# EasyEDA Pro project 小智.epro, schematic ESP32-S3-V1_0_1

## Sheets
1 P1: Board Name: 立创·实战派ESP32-S3开发板; Create Date: 2024-10-12; Page Name: P1; Project Name: 立创·实战派ESP32-S3开发板; Schematic Name: ESP32-S3-V1_0_1; Update Date: 2024-10-12; Company: 立创开发板 · 实战派; Page Size: A4; Version: V1.0.1
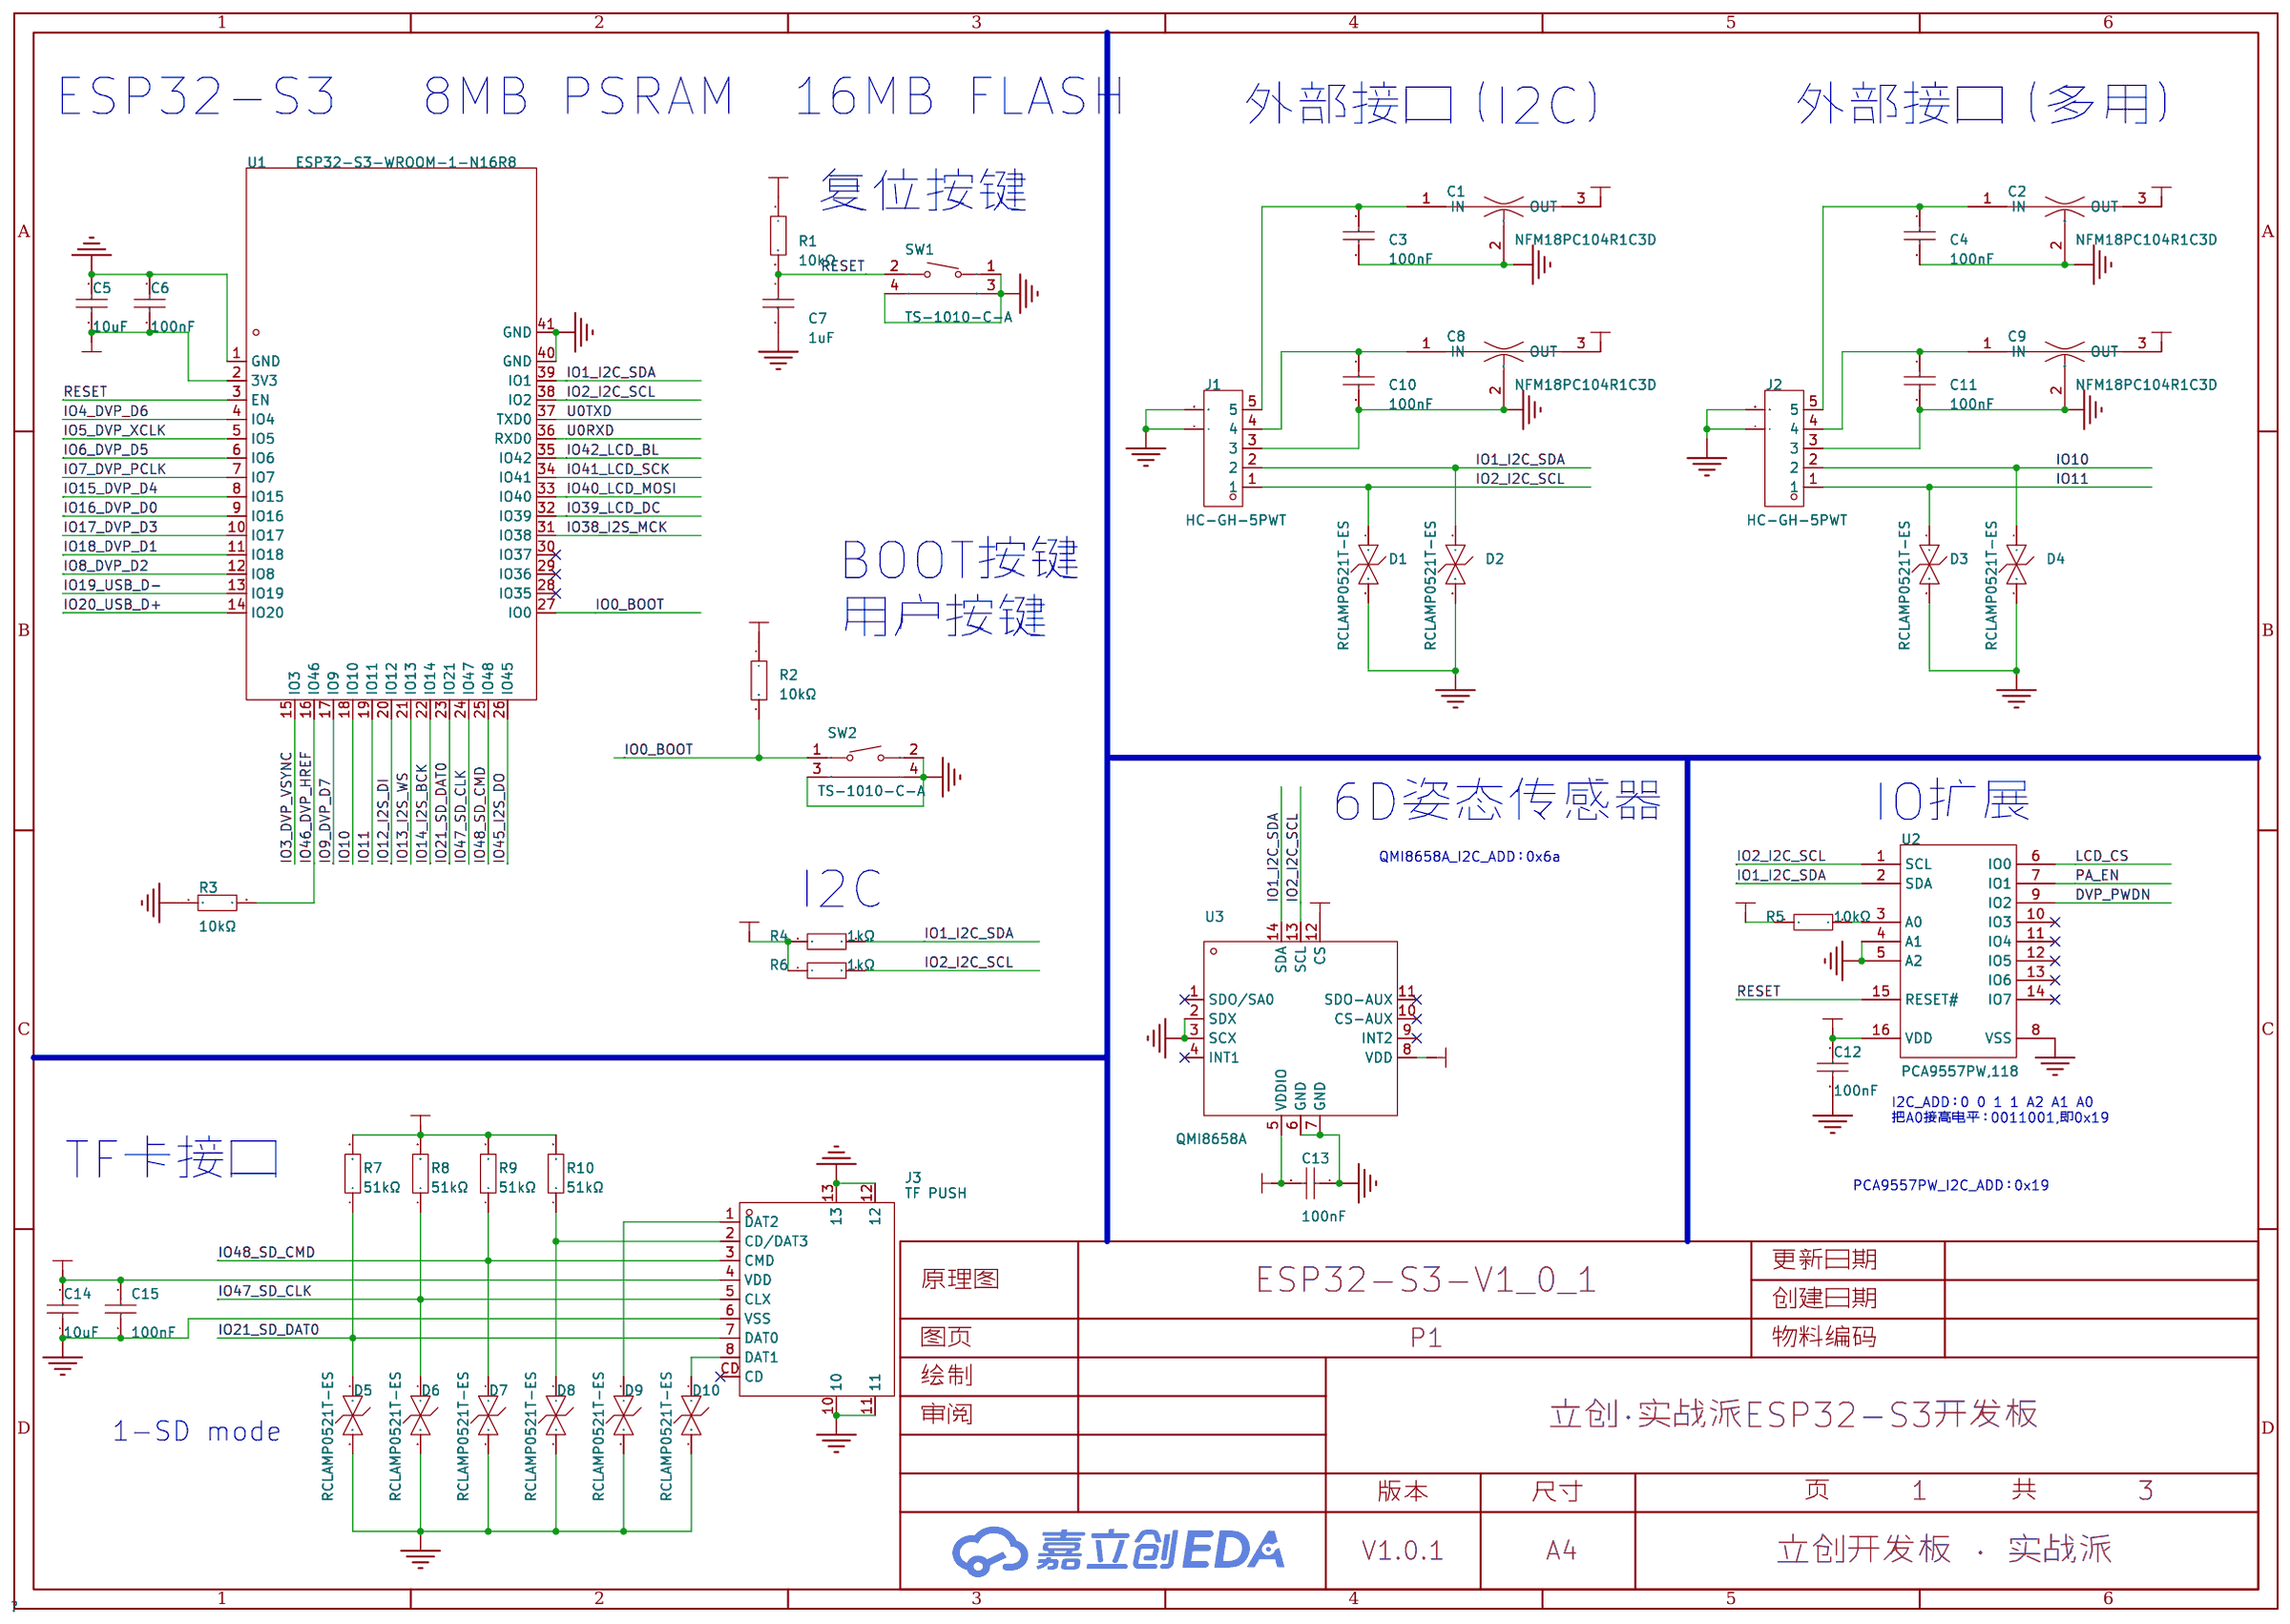
[diagram p0: P1]
2 P2: Board Name: Board1; Create Date: 2024-06-29; Page Name: P2; Project Name: XD-ESP32S3-V1_0_1; Update Date: 2024-08-06
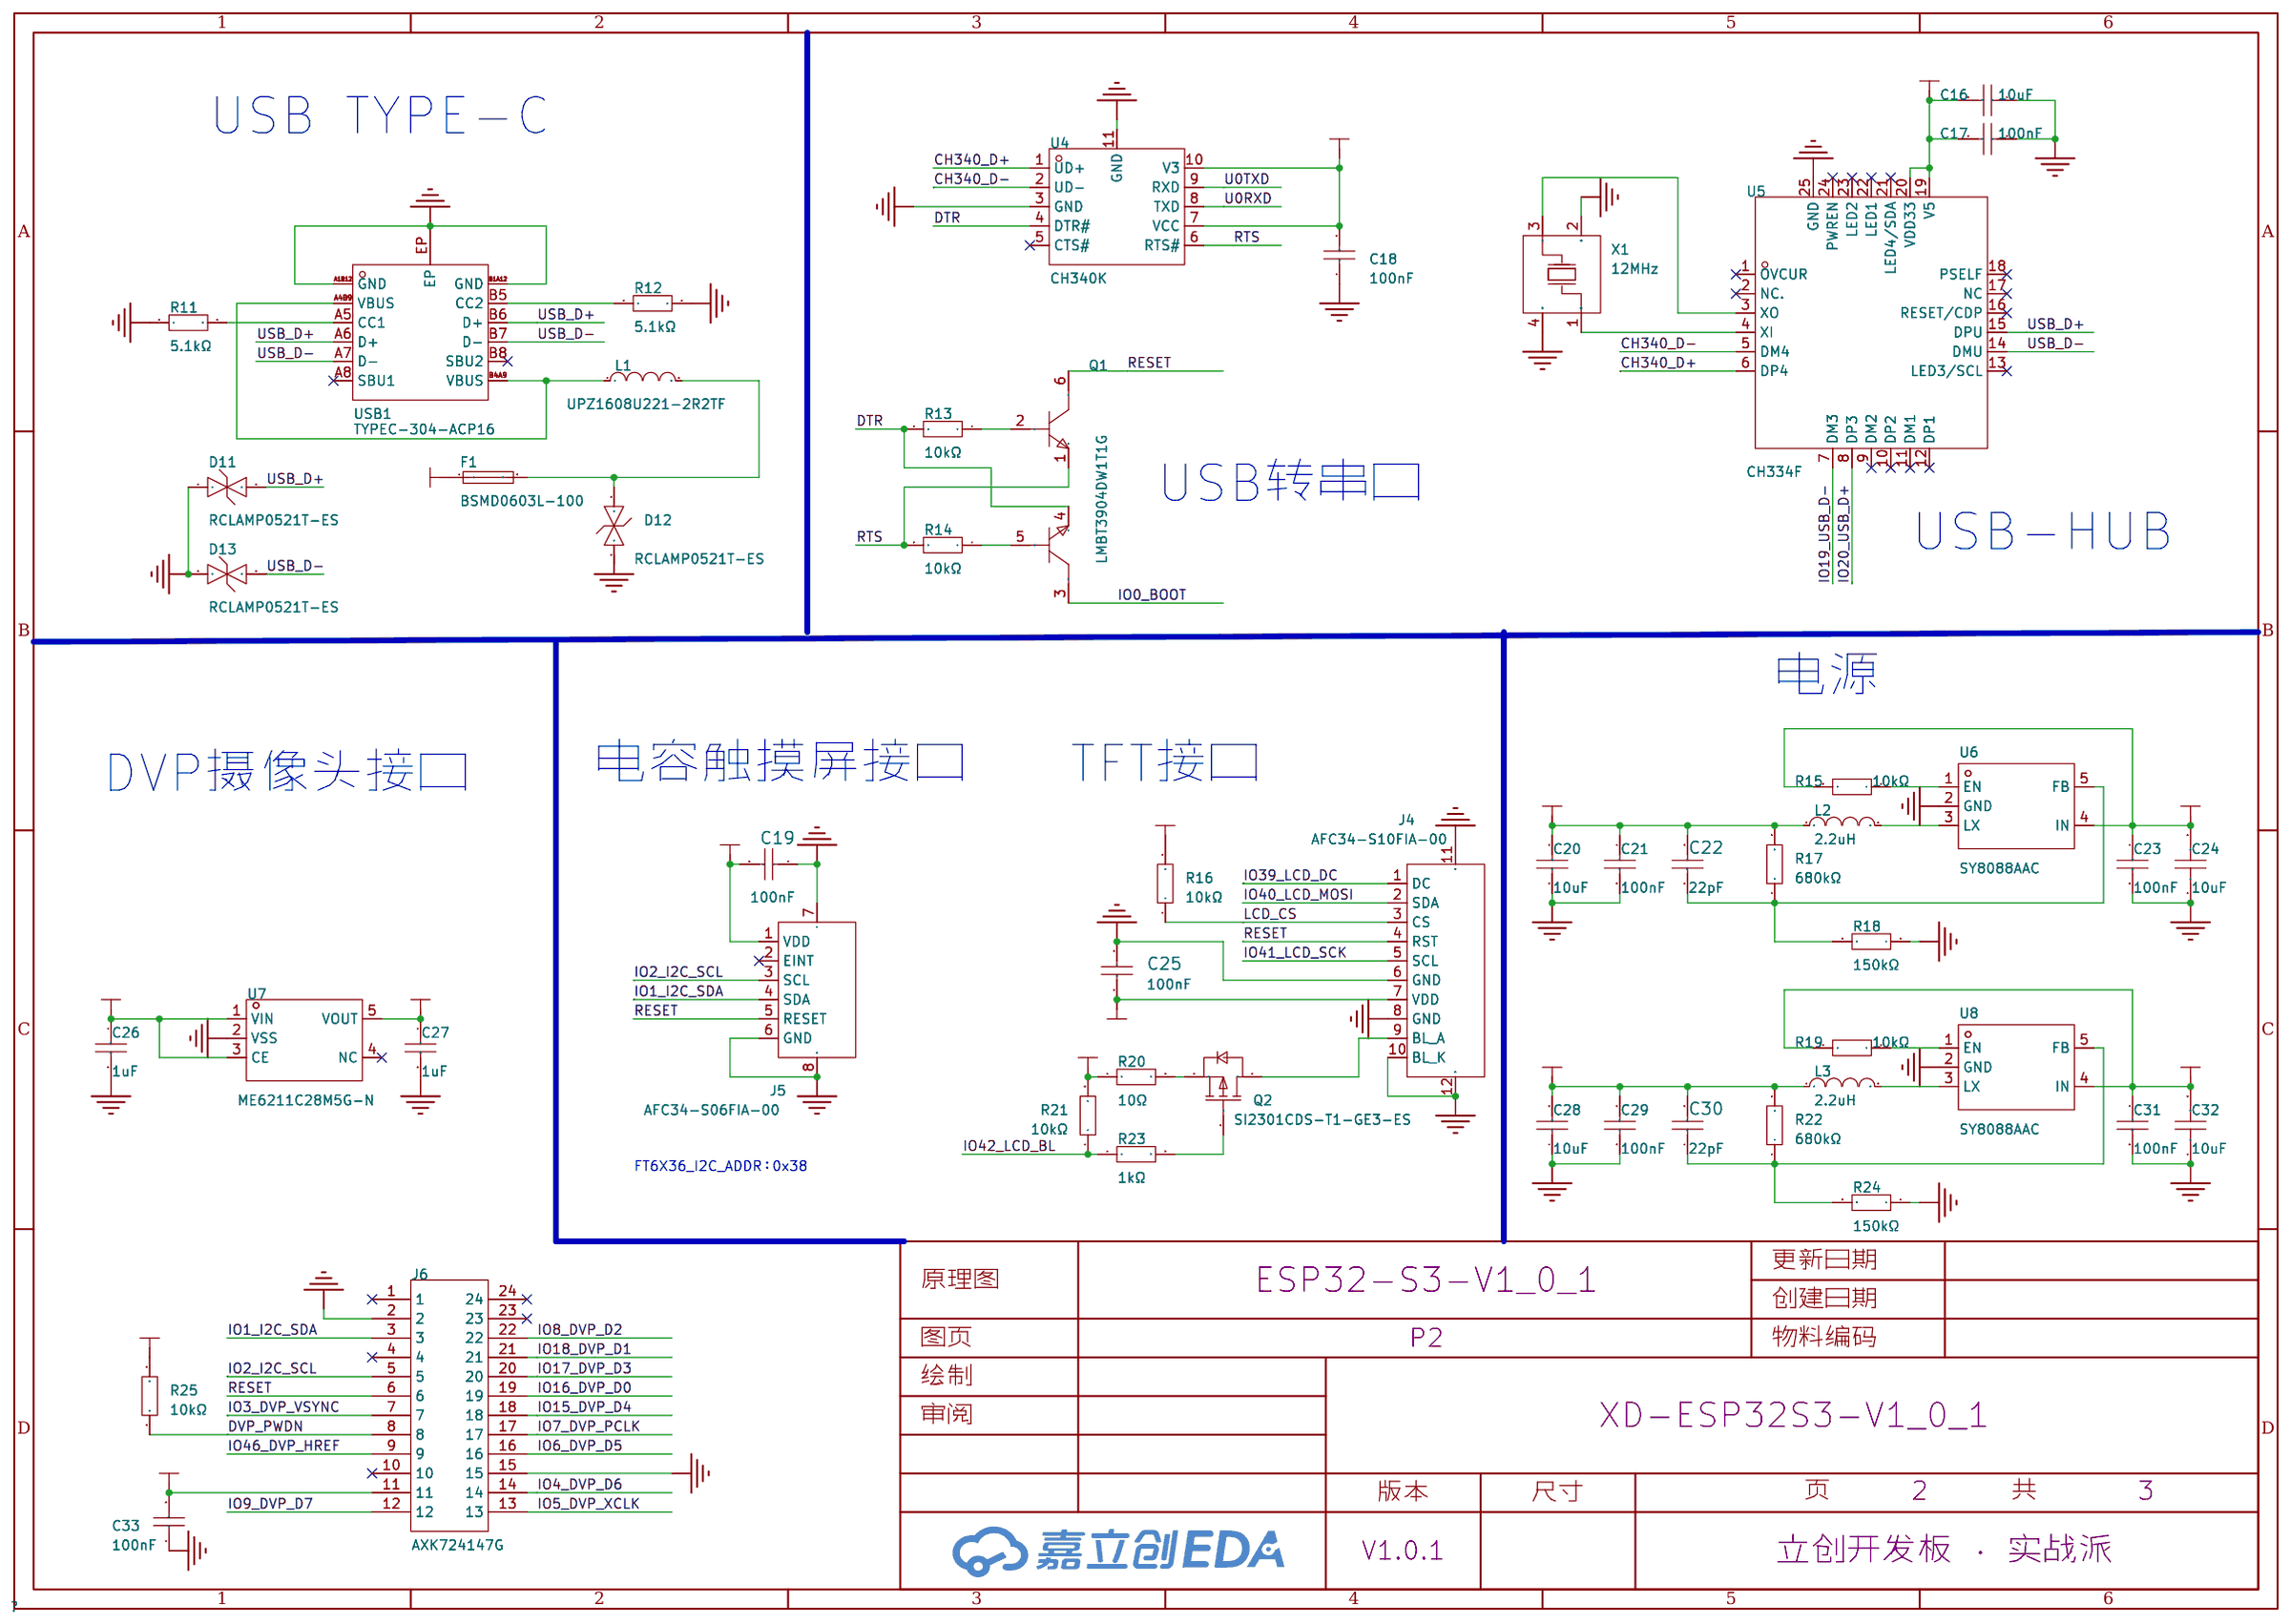
[diagram p1: P2]
3 P3: Board Name: Board1; Create Date: 2024-06-29; Page Name: P3; Project Name: XD-ESP32S3-V1_0_1; Update Date: 2024-08-06
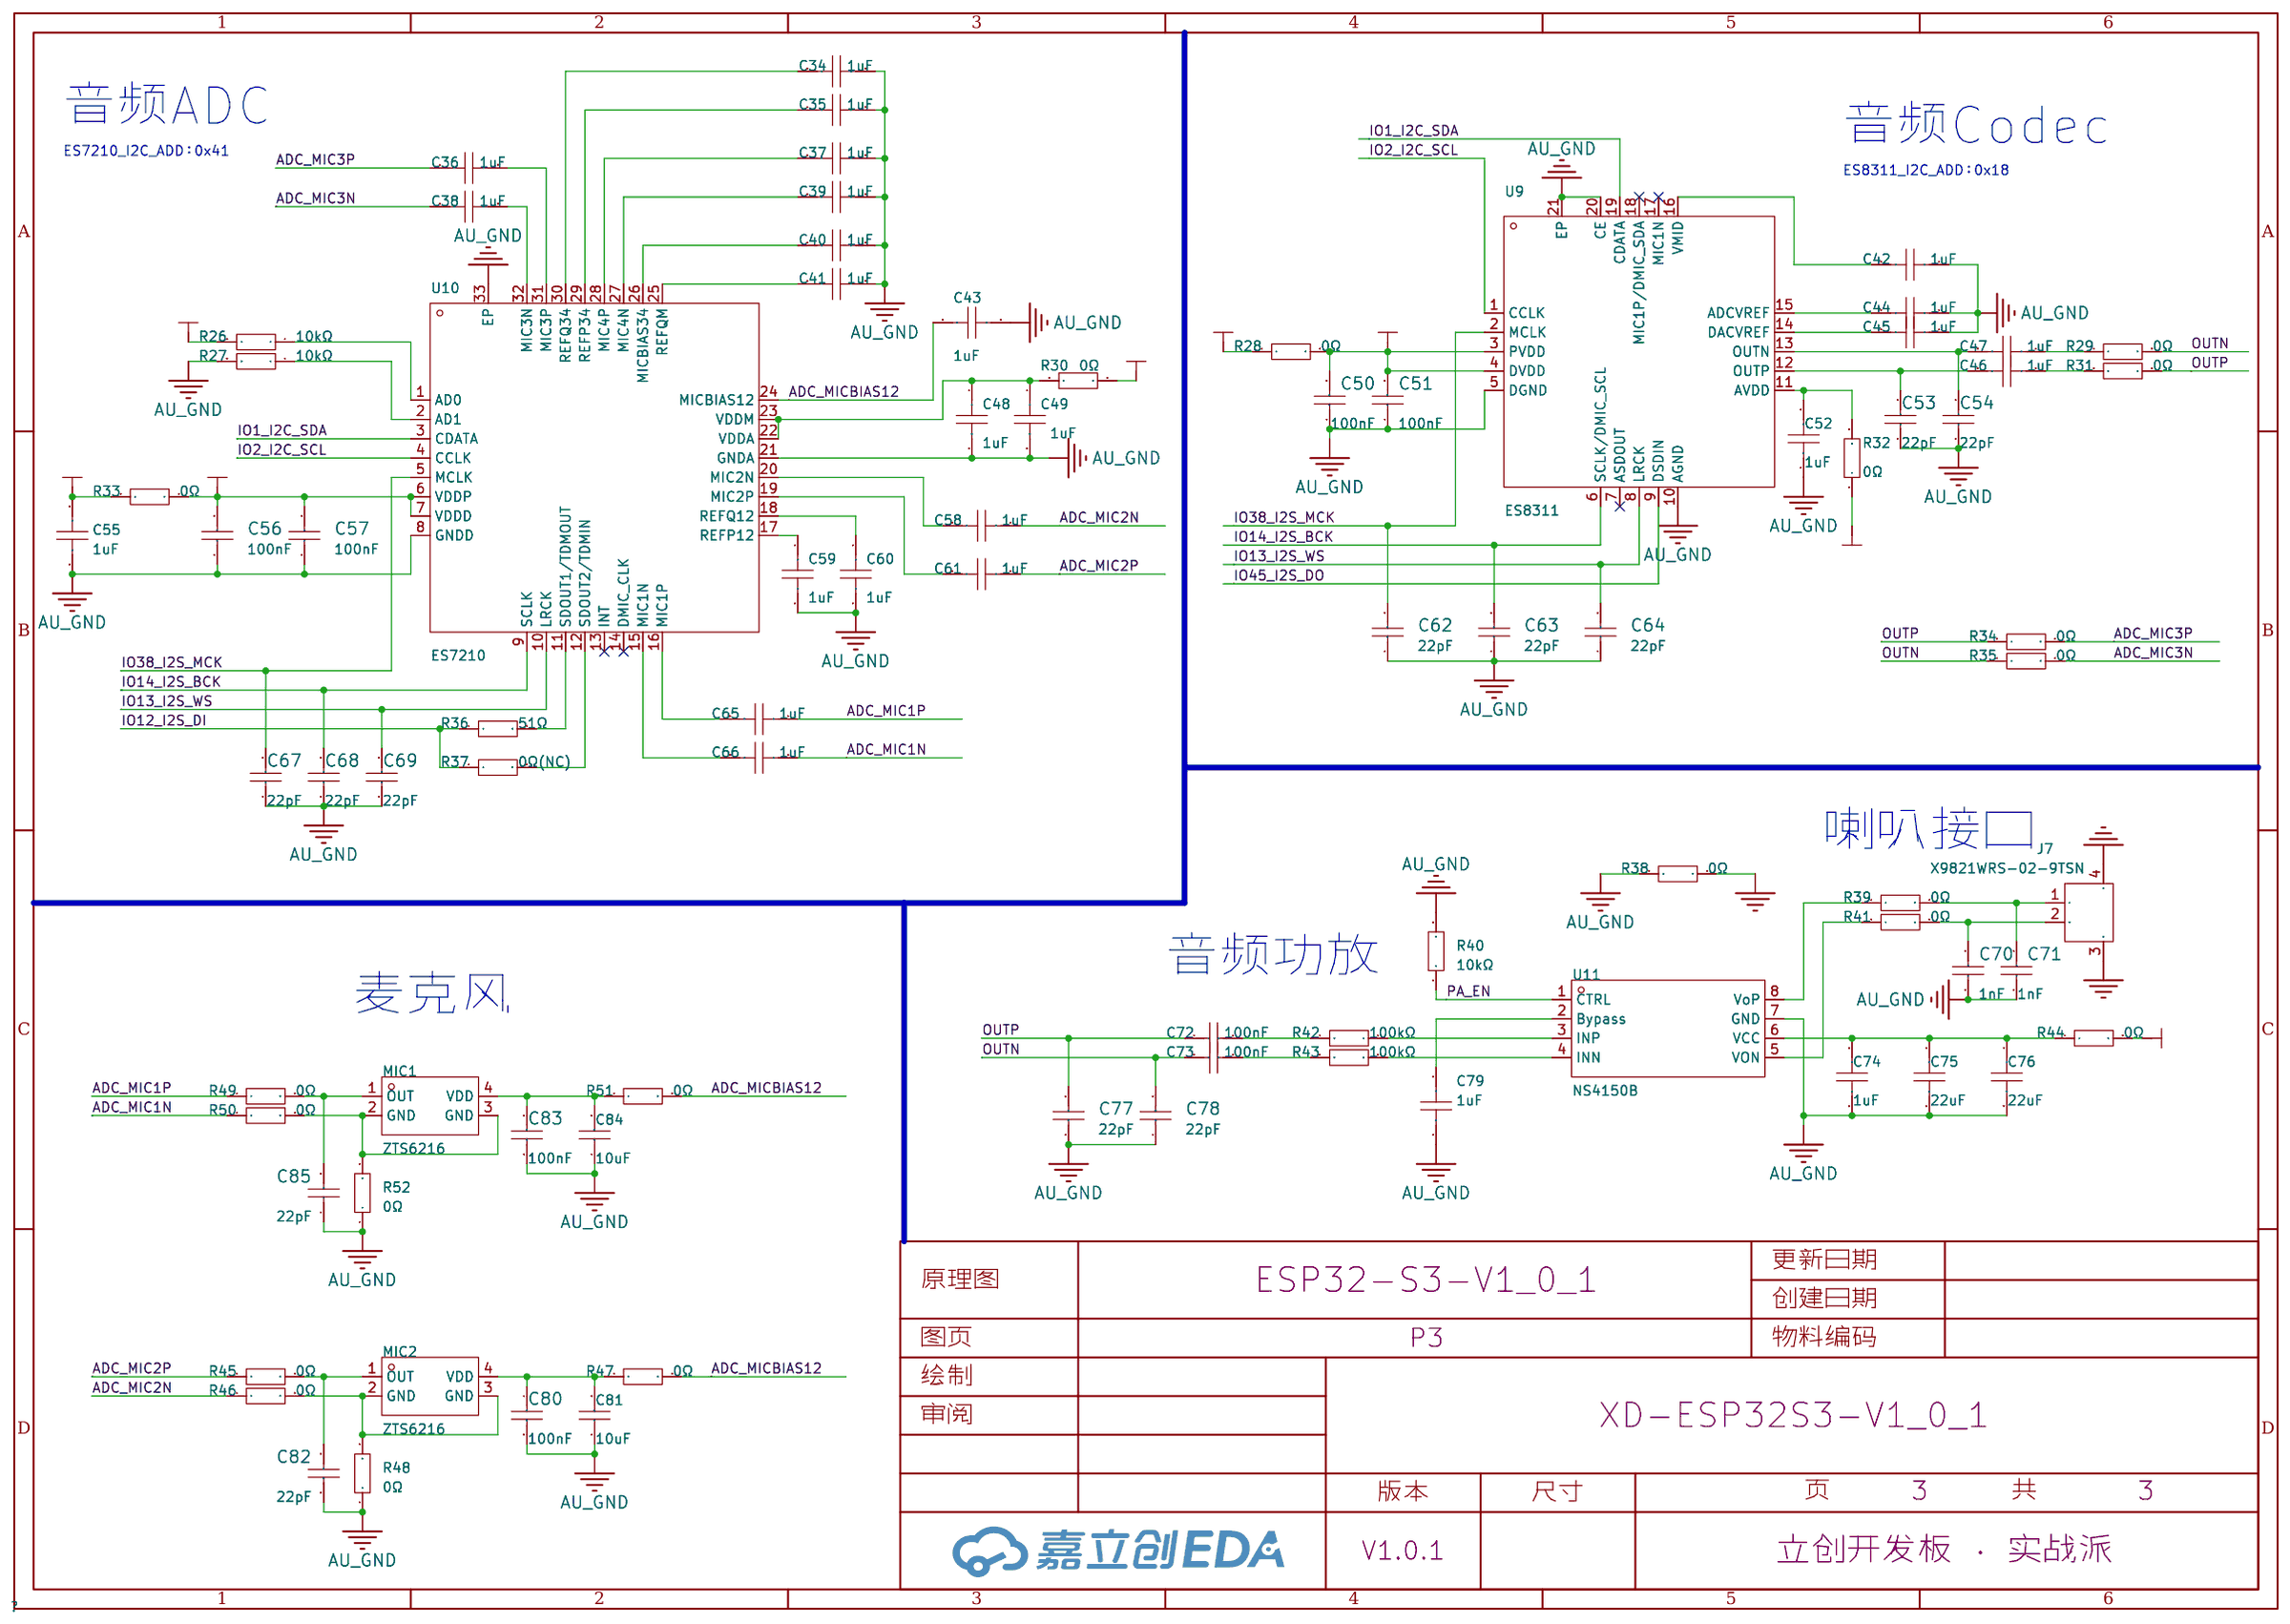
[diagram p2: P3]

## Parts
sheet P1
C1  NFM18PC104R1C3D  [FILTER-SMD_3P-L1.6-W0.8-L_NFM18CC223R1C3D]
C2  NFM18PC104R1C3D  [FILTER-SMD_3P-L1.6-W0.8-L_NFM18CC223R1C3D]
C3  100nF  [C0402]
C4  100nF  [C0402]
C5  10uF  [C0402]
C6  100nF  [C0402]
C7  1uF  [C0402]
C8  NFM18PC104R1C3D  [FILTER-SMD_3P-L1.6-W0.8-L_NFM18CC223R1C3D]
C9  NFM18PC104R1C3D  [FILTER-SMD_3P-L1.6-W0.8-L_NFM18CC223R1C3D]
C10  100nF  [C0402]
C11  100nF  [C0402]
C12  100nF  [C0402]
C13  100nF  [C0402]
C14  10uF  [C0402]
C15  100nF  [C0402]
D1  RCLAMP0521T-ES  [DFN1006-2L-BI]
D2  RCLAMP0521T-ES  [DFN1006-2L-BI]
D3  RCLAMP0521T-ES  [DFN1006-2L-BI]
D4  RCLAMP0521T-ES  [DFN1006-2L-BI]
D5  RCLAMP0521T-ES  [DFN1006-2L-BI]
D6  RCLAMP0521T-ES  [DFN1006-2L-BI]
D7  RCLAMP0521T-ES  [DFN1006-2L-BI]
D8  RCLAMP0521T-ES  [DFN1006-2L-BI]
D9  RCLAMP0521T-ES  [DFN1006-2L-BI]
D10  RCLAMP0521T-ES  [DFN1006-2L-BI]
J1  HC-GH-5PWT  [CONN-SMD_5P-P1.25_HC-GH-5PWTKK]
J2  HC-GH-5PWT  [CONN-SMD_5P-P1.25_HC-GH-5PWTKK]
J3  TF PUSH  [TF-SMD_TF-PUSH]
R1  10kΩ  [R0402]
R2  10kΩ  [R0402]
R3  10kΩ  [R0402]
R4  1kΩ  [R0402]
R5  10kΩ  [R0402]
R6  1kΩ  [R0402]
R7  51kΩ  [R0402]
R8  51kΩ  [R0402]
R9  51kΩ  [R0402]
R10  51kΩ  [R0402]
SW1  TS-1010-C-A  [KEY-SMD_TX-1010-X-X]
SW2  TS-1010-C-A  [KEY-SMD_TX-1010-X-X]
U1  ESP32-S3-WROOM-1-N16R8  [WIRELM-SMD_ESP32-S3-WROOM-1]
U2  PCA9557PW,118  [TSSOP-16_L5.0-W4.4-P0.65-LS6.4-BL]
U3  QMI8658A  [LGA-14_L3.0-W2.5-P0.50-TL]
sheet P2
C16  10uF  [C0402]
C17  100nF  [C0402]
C18  100nF  [C0402]
C19  100nF  [C0402]
C20  10uF  [C0402]
C21  100nF  [C0402]
C22  22pF  [C0402]
C23  100nF  [C0402]
C24  10uF  [C0603]
C25  100nF  [C0402]
C26  1uF  [C0402]
C27  1uF  [C0402]
C28  10uF  [C0402]
C29  100nF  [C0402]
C30  22pF  [C0402]
C31  100nF  [C0402]
C32  10uF  [C0603]
C33  100nF  [C0402]
D11  RCLAMP0521T-ES  [DFN1006-2L-BI]
D12  RCLAMP0521T-ES  [DFN1006-2L-BI]
D13  RCLAMP0521T-ES  [DFN1006-2L-BI]
F1  BSMD0603L-100  [F0603]
J4  AFC34-S10FIA-00  [FPC-SMD_AFC34-S10FIA-00]
J5  AFC34-S06FIA-00  [FPC-SMD_AFC34-S06FIA-00]
J6  AXK724147G  [CONN-SMD_AXK724147G]
L1  UPZ1608U221-2R2TF  [L0603]
L2  2.2uH  [IND-SMD_L2.5-W2.0-VLS252012CX-150M]
L3  2.2uH  [IND-SMD_L2.5-W2.0-VLS252012CX-150M]
Q1  LMBT3904DW1T1G  [SOT-363_L2.0-W1.3-P0.65-LS2.1-BR]
Q2  SI2301CDS-T1-GE3-ES  [SOT-23-3_L2.9-W1.3-P1.90-LS2.4-BR]
R11  5.1kΩ  [R0402]
R12  5.1kΩ  [R0402]
R13  10kΩ  [R0402]
R14  10kΩ  [R0402]
R15  10kΩ  [R0402]
R16  10kΩ  [R0402]
R17  680kΩ  [R0402]
R18  150kΩ  [R0402]
R19  10kΩ  [R0402]
R20  10Ω  [R0402]
R21  10kΩ  [R0402]
R22  680kΩ  [R0402]
R23  1kΩ  [R0402]
R24  150kΩ  [R0402]
R25  10kΩ  [R0402]
U4  CH340K  [ESOP-10_L4.9-W3.9-P1.00-LS6.0-BL-EP]
U5  CH334F  [QFN-24_L4.0-W4.0-P0.50-BL-EP2.8]
U6  SY8088AAC  [SOT-23-5_L3.0-W1.7-P0.95-LS2.8-BR]
U7  ME6211C28M5G-N  [SOT-23-5_L3.0-W1.7-P0.95-LS2.8-BR]
U8  SY8088AAC  [SOT-23-5_L3.0-W1.7-P0.95-LS2.8-BR]
USB1  TYPEC-304-ACP16  [USB-C-SMD_TYPE-C-16P-1]
X1  12MHz  [OSC-SMD_4P-L3.2-W2.5-BL]
sheet P3
C34  1uF  [C0402]
C35  1uF  [C0402]
C36  1uF  [C0402]
C37  1uF  [C0402]
C38  1uF  [C0402]
C39  1uF  [C0402]
C40  1uF  [C0402]
C41  1uF  [C0402]
C42  1uF  [C0402]
C43  1uF  [C0402]
C44  1uF  [C0402]
C45  1uF  [C0402]
C46  1uF  [C0402]
C47  1uF  [C0402]
C48  1uF  [C0402]
C49  1uF  [C0402]
C50  100nF  [C0402]
C51  100nF  [C0402]
C52  1uF  [C0402]
C53  22pF  [C0402]
C54  22pF  [C0402]
C55  1uF  [C0402]
C56  100nF  [C0402]
C57  100nF  [C0402]
C58  1uF  [C0402]
C59  1uF  [C0402]
C60  1uF  [C0402]
C61  1uF  [C0402]
C62  22pF  [C0402]
C63  22pF  [C0402]
C64  22pF  [C0402]
C65  1uF  [C0402]
C66  1uF  [C0402]
C67  22pF  [C0402]
C68  22pF  [C0402]
C69  22pF  [C0402]
C70  1nF  [C0402]
C71  1nF  [C0402]
C72  100nF  [C0402]
C73  100nF  [C0402]
C74  1uF  [C0402]
C75  22uF  [C0603]
C76  22uF  [C0603]
C77  22pF  [C0402]
C78  22pF  [C0402]
C79  1uF  [C0402]
C80  100nF  [C0402]
C81  10uF  [C0402]
C82  22pF  [C0402]
C83  100nF  [C0402]
C84  10uF  [C0402]
C85  22pF  [C0402]
J7  X9821WRS-02-9TSN  [CONN-SMD_2P-P1.25_X9821WRS-02-9TSN]
MIC1  ZTS6216  [MIC-SMD_4P-L2.8-W1.9-P1.84-TL]
MIC2  ZTS6216  [MIC-SMD_4P-L2.8-W1.9-P1.84-TL]
R26  10kΩ  [R0402]
R27  10kΩ  [R0402]
R28  0Ω  [R0402]
R29  0Ω  [R0402]
R30  0Ω  [R0402]
R31  0Ω  [R0402]
R32  0Ω  [R0402]
R33  0Ω  [R0402]
R34  0Ω  [R0402]
R35  0Ω  [R0402]
R36  51Ω  [R0402]
R37  0Ω(NC)  [R0402]
R38  0Ω  [R0402]
R39  0Ω  [R0402]
R40  10kΩ  [R0402]
R41  0Ω  [R0402]
R42  100kΩ  [R0402]
R43  100kΩ  [R0402]
R44  0Ω  [R0402]
R45  0Ω  [R0402]
R46  0Ω  [R0402]
R47  0Ω  [R0402]
R48  0Ω  [R0402]
R49  0Ω  [R0402]
R50  0Ω  [R0402]
R51  0Ω  [R0402]
R52  0Ω  [R0402]
U9  ES8311  [WQFN-20_L3.0-W3.0-P0.40-BL-EP1.7]
U10  ES7210  [QFN-32_L4.0-W4.0-P0.40-BL-EP2.7]
U11  NS4150B  [MSOP-8_L3.0-W3.0-P0.65-LS5.0-BL]

## Library data of the parts
C1 C2 C8 C9 = NFM15PC104D0J3D: 电容量:100nF;精度:±20%;直流电阻:30mΩ;; LCSC Part Name: 100nF(104) ±20% 16V; Supplier Part: C111493; Manufacturer: muRata(村田); Supplier Footprint: SMD-3P,0.8x1.6mm; JLCPCB Part Class: 扩展库; Datasheet: https://atta.szlcsc.com/upload/public/pdf/source/20170511/1494500112197.pdf; Supplier: LCSC; Nominal Capacitance: 100nF; CapacitanceTolerance: ±20%; DC Rated Voltage: 16V; Rated Current: 2A; DC Resistance: 30mΩ; Operating Temperature: -55℃~+125℃; Check: true
C3 C4 C6 C10-C13 C15 C17 C18 C21 C23 C29 C31 C33 C72 C73 = CL05B104KO5NNNC: 容值:100nF;精度:±10%;额定电压:16V;材质(温度系数):X7R;; LCSC Part Name: 100nF ±10% 16V; Supplier Part: C1525; Manufacturer: SAMSUNG(三星); Supplier Footprint: 0402; Datasheet: https://atta.szlcsc.com/upload/public/pdf/source/20160218/1457707763339.pdf; Supplier: LCSC; Tolerance: ±10%; Voltage Rated: 16V; Temperature Coefficient: X7R; Check: true
C5 C14 C16 C20 C28 C81 C84 = CL05A106MQ5NUNC: 容值:10uF;精度:±20%;额定电压:6.3V;材质(温度系数):X5R;; LCSC Part Name: 10uF ±20% 6.3V; Supplier Part: C15525; Manufacturer: SAMSUNG(三星); Supplier Footprint: 0402; Datasheet: https://atta.szlcsc.com/upload/public/pdf/source/20220823/2B02EE04F8F211D38A52DCB16EB6BEBA.pdf; Supplier: LCSC; Tolerance: ±20%; Voltage Rated: 6.3V; Temperature Coefficient: X5R; Check: true
C7 C26 C27 = CL05B104KO5NNNC: 容值:100nF;精度:±10%;额定电压:16V;材质(温度系数):X7R;; LCSC Part Name: 100nF ±10% 16V; Supplier Part: C52923; Manufacturer: SAMSUNG(三星); Manufacturer Part: CL05A105KA5NQNC; Supplier Footprint: 0402; Datasheet: https://atta.szlcsc.com/upload/public/pdf/source/20160218/1457707763339.pdf; Supplier: LCSC; Tolerance: ±10%; Voltage Rated: 16V; Temperature Coefficient: X7R; Check: true
D1-D13 = RCLAMP0521T-ES: 反向关断电压（典型值）:5V(Max) 击穿电压（最小值）:6.0V 箝位电压:12V 峰值脉冲电流:4A (8/20us) 极性:Bidirectional; LCSC Part Name: ESD/TVS 静电防护二极管; Supplier Part: C5180263; Manufacturer: ElecSuper(静芯微）; Supplier Footprint: DFN1006-2L; JLCPCB Part Class: 扩展库; Datasheet: https://atta.szlcsc.com/upload/public/pdf/source/20220919/A357E144777DA2AE4B95F331F746735C.pdf; Supplier: LCSC; Check: true
J1 J2 = HC-GH-5PWT_C3011947: 插针结构:1x5P;间距:1.25mm;公母:公;安装方式:卧贴;排数:1;每排PIN数:5;参考系列:GH;额定电流:1A;工作温度范围:-25℃~+85℃;; Supplier: LCSC; Supplier Part: C3011947; Manufacturer: HCTL(华灿天禄); JLCPCB Part Class: 扩展库; LCSC Part Name: 1x5P 间距:1.25mm 卧贴 系列:GH 卧式贴片带扣 镀锡 5P; Supplier Footprint: SMD,P=1.25mm; Datasheet: https://atta.szlcsc.com/upload/public/pdf/source/20210728/C2845397_2BAB5616F3DD52263F1EF5392BF0F2D4.pdf; Pins Structure: 1x5P; Pitch: 1.25mm; Gender: 公; Mounting Style: 卧贴; Number of Rows: 1; Number of PINs Per Row: 5; Reference Series: GH; Current Rating (Max): 1A; Operating Temperature Range: -25℃~+85℃; Check: true
J3 = TF PUSH: 卡连接方式:自弹式;卡类型:MicroSD卡(TF卡);连接器类型:卡座;本体最大高度:2mm;触头材质:-;触头镀层:-;工作温度范围:-20℃~+90℃;焊接温度(最大值):-;; LCSC Part Name: 自弹式 MicroSD卡(TF卡) 卡座; Supplier Part: C393941; Manufacturer: SHOU HAN(首韩); Supplier Footprint: SMD; JLCPCB Part Class: 扩展库; Datasheet: https://atta.szlcsc.com/upload/public/pdf/source/20191011/C393941_0DDD896EE907FEB750D8B7B8982E2A67.pdf; Supplier: LCSC; Card Connection Mode: 自弹式; Card Type: MicroSD卡(TF卡); Connector Type: 卡座; Maximum Body Height: 2mm; Operating Temperature Range: -20℃~+90℃; Additional Card Detection Pins: 无; Check: true
R1-R3 R5 R13-R16 R19 R21 R25-R27 R40 = 0402WGF1002TCE: 电阻类型:厚膜电阻;阻值:10kΩ;精度:±1%;功率:62.5mW;温度系数:±100ppm/℃;; LCSC Part Name: 厚膜电阻 10kΩ ±1% 62.5mW; Supplier Part: C25744; Manufacturer: UNI-ROYAL(厚声); Supplier Footprint: 0402; Datasheet: https://atta.szlcsc.com/upload/public/pdf/source/20200306/C422600_1E6D84923E4A46A82E41ADD87F860B5C.pdf; Supplier: LCSC; Type: 厚膜电阻; Tolerance: ±1%; Power(Watts): 62.5mW; Temperature Coefficient: ±100ppm/℃; Overload Voltage (Max): 50V; Operating Temperature Range: -55℃~+155℃; Check: true
R4 R6 R23 = 0402WGF1001TCE: 电阻类型:厚膜电阻;阻值:1kΩ;精度:±1%;功率:62.5mW;; LCSC Part Name: 1kΩ ±1% 62.5mW; Supplier Part: C11702; Manufacturer: UNI-ROYAL(厚声); Supplier Footprint: 0402; Datasheet: https://atta.szlcsc.com/upload/public/pdf/source/20200306/C422600_1E6D84923E4A46A82E41ADD87F860B5C.pdf; Supplier: LCSC; Type: 厚膜电阻; Tolerance: ±1%; Power(Watts): 62.5mW; Temperature Coefficient: ±100ppm/℃; Overload Voltage (Max): 50V; Operating Temperature Range: -55℃~+155℃; Check: true
R7-R10 = 0402WGF5102TCE: 电阻类型:厚膜电阻;阻值:51kΩ;精度:±1%;功率:62.5mW;最大工作电压:50V;温度系数:±100ppm/℃;; LCSC Part Name: 51kΩ ±1% 62.5mW 厚膜电阻; Supplier Part: C25794; Manufacturer: UNI-ROYAL(厚声); Supplier Footprint: 0402; JLCPCB Part Class: 基础库; Datasheet: https://atta.szlcsc.com/upload/public/pdf/source/20200306/C422600_1E6D84923E4A46A82E41ADD87F860B5C.pdf; Supplier: LCSC; Type: 厚膜电阻; Tolerance: ±1%; Power(Watts): 62.5mW; Overload Voltage (Max): 50V; Temperature Coefficient: ±100ppm/℃; Operating Temperature Range: -55℃~+155℃
SW1 SW2 = TS-1010-C-A: 电路结构:单刀单掷;按钮形状:矩形按钮;作用力:260gf;安装方式:卧贴;开关长度:2.3mm;开关宽度:4.7mm;开关高度:3.5mm;带支架:不带;触点电流:50mA;额定电压(AC):-;额定电压(DC):12V;额定功率:-;绝缘电阻:-;带灯:无;机械寿命:10万次;; LCSC Part Name: 2.3*4.7*3.5mm 卧贴 轻触开关; Supplier Part: C692458; Manufacturer: XKB Connectivity(中国星坤); Supplier Footprint: SMD; JLCPCB Part Class: 扩展库; Datasheet: https://atta.szlcsc.com/upload/public/pdf/source/20211011/09621D275CE0F472C941775DFBBCCC96.pdf; Supplier: LCSC; Circuit: 单刀单掷; Actuator Style: 矩形按钮; Operating Force: 260gf; Mounting Style: 卧贴; Switch Length: 2.3mm; Switch Width: 4.7mm; Switch Height: 3.5mm; Strike Gundam: 不带; Contact Current: 50mA; Voltage Rating (DC): 12V; Actuator/Cap Color: 黑色; With Lamp: 无; Mechanical Life: 10万次; Operating Temperature: -30℃~+85℃; Check: true
U1 = ESP32-S3-WROOM-1-N16R8: LCSC Part Name: 通用型Wi-Fi+低功耗蓝牙MCU模组; Supplier Part: C2913202; Manufacturer: ESPRESSIF(乐鑫); Supplier Footprint: SMD,18x25.5mm; JLCPCB Part Class: 扩展库; Datasheet: https://atta.szlcsc.com/upload/public/pdf/source/20220705/4E799F39581577F766659887F738A439.pdf; Supplier: LCSC; Check: true
U2 = PCA9557PW,118: 接口:I2C；SMBus;I/O数量:8;时钟频率:400kHz;; LCSC Part Name: 带复位的8位I2C总线和SMBus I/O端口; Supplier Part: C141380; Manufacturer: NXP(恩智浦); Supplier Footprint: TSSOP-16; JLCPCB Part Class: 扩展库; Datasheet: https://atta.szlcsc.com/upload/public/pdf/source/20171113/C141380_15105613218811115809.pdf; Supplier: LCSC; Interface: I2C；SMBus; Number of I/O: 8; Interrupt Output: 无中断输出; Output Type: 开漏；推挽式; Supply Voltage: 2.3V~5.5V; Output Source current: 10mA; Output Sink Current: 20mA; Clock Frequency: 400kHz; Operating Temperature: -40℃~+85℃; Check: true
U3 = QMI8658A_C3021082: LCSC Part Name: 六轴陀螺仪; Supplier Part: C3021082; Manufacturer: QST(上海矽睿); Supplier Footprint: LGA-14; JLCPCB Part Class: 扩展库; Datasheet: https://atta.szlcsc.com/upload/public/pdf/source/20230804/748E61E1BAEF8C31413DC641004C80DF.pdf; Supplier: LCSC
C19 C25 C50 C51 C56 C57 C80 C83 = 0402B104K500NT: 温度系数:X7R;容值:100nF;精度:±10%;额定电压:50V;; LCSC Part Name: 100nF(104) ±10% 50V; Supplier Part: C110251; Manufacturer: FH(风华); Supplier Footprint: 0402; Supplier: LCSC; Temperature Coefficient: X7R; Tolerance: ±10%; Voltage Rated: 50V; Check: true
C22 C30 C53 C54 C62-C64 C67-C69 C77 C78 C82 C85 = 0402CG220J500NT: 容值:22pF;精度:±5%;额定电压:50V;材质(温度系数):C0G;; LCSC Part Name: 22pF ±5% 50V; Supplier Part: C1555; Manufacturer: FH(风华); Supplier Footprint: 0402; Datasheet: https://atta.szlcsc.com/upload/public/pdf/source/20200305/C486355_26A10D38EF8C2A5C37091D0039909270.pdf; Supplier: LCSC; Tolerance: ±5%; Voltage Rated: 50V; Temperature Coefficient: C0G; Check: true
C24 C32 = CL10A106MA8NRNC: 容值:10uF;精度:±20%;额定电压:25V;材质(温度系数):X5R;; LCSC Part Name: 10uF ±20% 25V; Supplier Part: C96446; Manufacturer: SAMSUNG(三星); Supplier Footprint: 0603; JLCPCB Part Class: 基础库; Datasheet: https://atta.szlcsc.com/upload/public/pdf/source/20160218/1457707763339.pdf; Supplier: LCSC; Tolerance: ±20%; Voltage Rated: 25V; Temperature Coefficient: X5R; Check: true
F1 = BSMD0603L-100: 最大电压:6V;最大电流:50A;保持电流:1A;跳闸电流:2A;; LCSC Part Name: 6V 1A 0603自恢复 0.5秒内动作; Supplier Part: C2757929; Manufacturer: BHFUSE(佰宏); Supplier Footprint: 0603; Datasheet: https://atta.szlcsc.com/upload/public/pdf/source/20220302/2A10C742043E0D0C785528ECCB29DF68.pdf; Supplier: LCSC; Operating Voltage (Max): 6V; Current Rating (Max): 50A; Hold Current: 1A; Trip Current: 2A; Power Dissipation: 1W; Resistance - Initial (Ri) (Min): 9mΩ; Resistance - Post Trip (R1) (Max): 80mΩ; Maximum Time to Trip: 500ms; Operating Temperature: -40℃~+85℃; Check: true
J4 = SPI_TFT_ST7789_10P: 间距:0.5mm;触点数量:10P;锁定特性:翻盖式;安装类型:卧贴;触点类型:双侧触点/上下接;工作温度范围:-;; Supplier: LCSC; Supplier Part: C2842524; Manufacturer: JS(钜硕电子); LCSC Part Name: 0.5mm P数:10P 翻盖式 双侧触点/上下接; Supplier Footprint: SMD,P=0.5mm; Datasheet: https://atta.szlcsc.com/upload/public/pdf/source/20210625/C2842522_304827EECBF4FCC65631E85A89FB6478.pdf; Pitch: 0.5mm; Number of Contacts: 10P; Locking Feature: 翻盖式; Mounting Type: 卧贴; Contact Type: 双侧触点/上下接; Height Above Board: 1.2mm; FFC, FCB Thickness: 0.3mm; Check: true
J5 = LCD_TOUCH_FT6X36: 间距:0.5mm;触点数量:6P;锁定特性:翻盖式;安装类型:卧贴;触点类型:双侧触点/上下接;工作温度范围:-;; Supplier: LCSC; Supplier Part: C2842522; Manufacturer: JS(钜硕电子); LCSC Part Name: 0.5mm P数:6P 翻盖式 双侧触点/上下接; Supplier Footprint: SMD,P=0.5mm; Datasheet: https://atta.szlcsc.com/upload/public/pdf/source/20210625/C2842522_304827EECBF4FCC65631E85A89FB6478.pdf; Pitch: 0.5mm; Number of Contacts: 6P; Locking Feature: 翻盖式; Mounting Type: 卧贴; Contact Type: 双侧触点/上下接; Height Above Board: 1.2mm; FFC, FCB Thickness: 0.3mm; Check: true
J6 = AXK724147G: PIN总数:24P;间距:0.4mm;公母:母;安装方式:立贴;行数:2;; Supplier: LCSC; Supplier Part: C114816; Manufacturer: PANASONIC(松下); JLCPCB Part Class: 扩展库; LCSC Part Name: 间距:0.4mm PIN:24P 母 立贴; Supplier Footprint: SMD,P=0.4mm; Datasheet: https://atta.szlcsc.com/upload/public/pdf/source/20180709/C114816_A9AB74CA8F2978F45F88437EFA713D8B.pdf; Number of Pins: 24P; Pitch: 0.4mm; Gender: 母; Mounting Style: 立贴; Number of Rows: 2
L1 = UPZ1608U221-2R2TF: 标称阻抗@测试频率:220Ω@100MHz;误差:±25%;直流电阻(RDC):50mΩ;额定电流:2.2A;电路数:1;; LCSC Part Name: 220Ω@100MHz ±25%; Supplier Part: C279745; Manufacturer: Sunlord(顺络); Supplier Footprint: SMD; JLCPCB Part Class: 扩展库; Datasheet: https://atta.szlcsc.com/upload/public/pdf/source/20210916/3C06D8971A361A4569490E57F6B8A429.pdf; Supplier: LCSC; Impedance @ Frequency: 220Ω@100MHz; Tolerance: ±25%; DC Resistance: 50mΩ; Current Rating: 2.2A; Circuits: 1; Check: true
L2 L3 = FXLB252012-2R2-M: 电感值:2.2uH;精度:±20%;额定电流:3A;饱和电流(Isat):3.3A;类型:一体成型电感;; LCSC Part Name: 2.2uH ±20% 3.3A; Supplier Part: C3040393; Manufacturer: cjiang(长江微电); Supplier Footprint: SMD,2.5x2.0x1.2mm; JLCPCB Part Class: 扩展库; Datasheet: https://atta.szlcsc.com/upload/public/pdf/source/20220812/975CD70F8F8BB72DF45FA36D37878048.pdf; Supplier: LCSC; Tolerance: ±20%; Rated Current: 3A; Saturation Current (Isat): 3.3A; DC Resistance (DCR): 68mΩ; Type: 一体成型电感; Ratings: AEC-Q200; Check: true
Q1 = LMBT3904DW1T1G: 晶体管类型:2个NPN;集射极击穿电压(Vceo):40V;集电极电流(Ic):200mA;功率(Pd):150mW;直流电流增益(hFE@Ic,Vce):100@10mA,1V;; Supplier: LCSC; Manufacturer: LRC(乐山无线电); Supplier Part: C131781; LCSC Part Name: 2个NPN 耐压:40V 电流:200mA; Supplier Footprint: SC-88; Datasheet: https://atta.szlcsc.com/upload/public/pdf/source/20170918/C131781_1505703476125975491.pdf; Transistor Type: 2个NPN; Collector-Emitter Breakdown Voltage (Vceo): 40V; Collector Current (Ic): 200mA; Power Dissipation (Pd): 150mW; Collector-Emitter Saturation Voltage (VCE(sat)@Ic,Ib): 300mV@50mA,5mA; DC Current Gain (hFE@Ic,Vce): 100@10mA,1V; Transition Frequency (fT): 300MHz; Operating Temperature: -55℃~+150℃@(Tj); Check: true
Q2 = SI2301CDS-T1-GE3-ES: 类型:P沟道;漏源电压(Vdss):20V;连续漏极电流(Id):3A;功率(Pd):1W;导通电阻(RDS(on)@Vgs,Id):58mΩ@4.5V,3A;; LCSC Part Name: P沟道 20V 3A; Supplier Part: C5224168; Manufacturer: ElecSuper(静芯微）; Supplier Footprint: SOT-23; Datasheet: https://atta.szlcsc.com/upload/public/pdf/source/20221027/42CFC3ED47648D38F0E217DE38FA5A17.pdf; Supplier: LCSC; Type: P沟道; Drain Source Voltage (Vdss): 20V; Continuous Drain Current (Id): 3A; Power Dissipation (Pd): 1W; Drain Source On Resistance (RDS(on)@Vgs,Id): 58mΩ@4.5V,3A; Gate Threshold Voltage (Vgs(th)@Id): 700mV@250uA; Check: true
R11 R12 = 0402WGF5101TCE: 电阻类型:厚膜电阻;阻值:5.1kΩ;精度:±1%;功率:62.5mW;温度系数:±100ppm/℃;; LCSC Part Name: 厚膜电阻 5.1kΩ ±1% 62.5mW; Supplier Part: C25905; Manufacturer: UNI-ROYAL(厚声); Supplier Footprint: 0402; JLCPCB Part Class: 基础库; Datasheet: https://atta.szlcsc.com/upload/public/pdf/source/20200306/C422600_1E6D84923E4A46A82E41ADD87F860B5C.pdf; Supplier: LCSC; Type: 厚膜电阻; Tolerance: ±1%; Power(Watts): 62.5mW; Temperature Coefficient: ±100ppm/℃; Overload Voltage (Max): 50V; Operating Temperature Range: -55℃~+155℃; Check: true
R17 R22 = 0402WGF6803TCE: 电阻类型:厚膜电阻;阻值:680kΩ;精度:±1%;功率:62.5mW;最大工作电压:50V;温度系数:±100ppm/℃;; LCSC Part Name: 680kΩ ±1% 62.5mW 厚膜电阻; Supplier Part: C4131; Manufacturer: UNI-ROYAL(厚声); Supplier Footprint: 0402; JLCPCB Part Class: 扩展库; Datasheet: https://atta.szlcsc.com/upload/public/pdf/source/20200306/C422600_1E6D84923E4A46A82E41ADD87F860B5C.pdf; Supplier: LCSC; Type: 厚膜电阻; Tolerance: ±1%; Power(Watts): 62.5mW; Overload Voltage (Max): 50V; Temperature Coefficient: ±100ppm/℃; Operating Temperature Range: -55℃~+155℃; Check: true
R18 R24 = 0402WGF1503TCE: 电阻类型:厚膜电阻;阻值:150kΩ;精度:±1%;功率:62.5mW;最大工作电压:50V;温度系数:±100ppm/℃;; LCSC Part Name: 150kΩ ±1% 62.5mW 厚膜电阻; Supplier Part: C25755; Manufacturer: UNI-ROYAL(厚声); Supplier Footprint: 0402; JLCPCB Part Class: 扩展库; Datasheet: https://atta.szlcsc.com/upload/public/pdf/source/20200306/C422600_1E6D84923E4A46A82E41ADD87F860B5C.pdf; Supplier: LCSC; Type: 厚膜电阻; Tolerance: ±1%; Power(Watts): 62.5mW; Overload Voltage (Max): 50V; Temperature Coefficient: ±100ppm/℃; Operating Temperature Range: -55℃~+155℃; Check: true
R20 = 0402WGF100JTCE: 电阻类型:厚膜电阻;阻值:10Ω;精度:±1%;功率:62.5mW;温度系数:±200ppm/℃;; LCSC Part Name: 厚膜电阻 10Ω ±1% 62.5mW; Supplier Part: C25077; Manufacturer: UNI-ROYAL(厚声); Supplier Footprint: 0402; Datasheet: https://atta.szlcsc.com/upload/public/pdf/source/20200306/C422600_1E6D84923E4A46A82E41ADD87F860B5C.pdf; Supplier: LCSC; Type: 厚膜电阻; Tolerance: ±1%; Power(Watts): 62.5mW; Temperature Coefficient: ±200ppm/℃; Overload Voltage (Max): 50V; Operating Temperature Range: -55℃~+155℃; Check: true
U4 = CH340K_C18208922: LCSC Part Name: CH340K 人工转编带; Supplier Part: C18208922; Manufacturer: WCH(南京沁恒); Supplier Footprint: ESSOP-10-150mil-1mm; JLCPCB Part Class: 扩展库; Datasheet: https://atta.szlcsc.com/upload/public/pdf/source/20240313/9D833A30DDFD16C064A7ADE10A944019.pdf; Supplier: LCSC; Check: true
U5 = CH334F_C5187527: Supplier Part: C5187527; Manufacturer: WCH(南京沁恒); Supplier Footprint: QFN-24(4x4); JLCPCB Part Class: 扩展库; Datasheet: https://atta.szlcsc.com/upload/public/pdf/source/20240313/0A90B4344DBFB1B295B73A4884A13F29.pdf; Supplier: LCSC; Check: true
U6 U8 = SY8088AAC: 功能类型:降压型;输入电压:-;输出电流(最大值):-;; Supplier Part: C79313; Manufacturer: silergy(矽力杰); Supplier Footprint: SOT-23-5; JLCPCB Part Class: 扩展库; Datasheet: https://atta.szlcsc.com/upload/public/pdf/source/20170329/1490752163260.pdf; Supplier: LCSC; Function: 降压型; Switch tube (built-in/external): 内置; Check: true
U7 = ME6211C28M5G-N: 输出类型:固定;最大输入电压:6V;输出电压:2.8V;最大输出电流:450mA;电源纹波抑制比(PSRR):70dB@(1kHz);输出极性:正极;; Supplier: LCSC; Manufacturer: MICRONE(南京微盟); Supplier Part: C53099; JLCPCB Part Class: 扩展库; LCSC Part Name: 输入6V 输出2.8V 450mA; Supplier Footprint: SOT-23-5; Datasheet: https://atta.szlcsc.com/upload/public/pdf/source/20171014/C53099_15079757529561038531.pdf; Output Type: 固定; Maximum Input Voltage: 6V; Output Voltage: 2.8V; MAX Output Current: 450mA; Power Supply Rejection Ratio (PSRR): 70dB@(1kHz); Dropout Voltage: 220mV@(200mA); Output Polarity: 正极; Number of Outputs: 1; Check: true
USB1 = TYPEC-304-ACP16: 连接器类型:Type-C;标准:-;公母:母;端口数量:1;触点数量:16P;安装方式:卧贴;额定电流 - 电源:3A;触头材质:铜;触头镀层:金;工作温度范围:-40℃~+85℃;焊接温度(最大值):-;; LCSC Part Name: Type-C 母 卧贴; Supplier Part: C2982555; Manufacturer: XUNPU(讯普); Supplier Footprint: SMD; Datasheet: https://atta.szlcsc.com/upload/public/pdf/source/20220311/3C907F75E12F45E4EE7F73565AB9C294.pdf; Supplier: LCSC; Connector Type: Type-C; Gender: 母; Number of Ports: 1; Number of Contacts: 16P; Mounting Style: 卧贴; Current Rating - Power (Max): 3A; Contact Material: 铜; Contact Plating: 金; Operating Temperature Range: -40℃~+85℃; Check: true
X1 = X322512MSB4SI: 晶振类型:贴片晶振;频率:12MHz;常温频差:±10ppm;外接负载电容:20pF;频率稳定度(全温):±20ppm;; LCSC Part Name: 12MHz ±10ppm 20pF; Supplier Part: C9002; Manufacturer: YXC(扬兴晶振); Supplier Footprint: SMD3225-4P; JLCPCB Part Class: 基础库; Datasheet: https://atta.szlcsc.com/upload/public/pdf/source/20240329/19D5F850207469550BEB00D7DFEDBC7A.pdf; Supplier: LCSC; Crystal Type: 贴片晶振; Normal temperature Frequency Tolerance: ±10ppm; External load capacitor: 20pF; Frequency Stability(Full temperature range): ±20ppm; Operating Temperature: -40℃~+85℃; Check: true
C34-C49 C52 C55 C58-C61 C65 C66 C74 C79 = CL05A105KA5NQNC: 容值:1uF;精度:±10%;额定电压:25V;材质(温度系数):X5R;; LCSC Part Name: 1uF ±10% 25V; Supplier Part: C52923; Manufacturer: SAMSUNG(三星); Supplier Footprint: 0402; Datasheet: https://atta.szlcsc.com/upload/public/pdf/source/20160103/1457707735223.pdf; Supplier: LCSC; Tolerance: ±10%; Voltage Rated: 25V; Temperature Coefficient: X5R; Check: true
C70 C71 = 0402B102K500NT: 容值:1nF;精度:±10%;额定电压:50V;材质(温度系数):X7R;; LCSC Part Name: 1nF ±10% 50V; Supplier Part: C1523; Manufacturer: FH(风华); Supplier Footprint: 0402; Datasheet: https://atta.szlcsc.com/upload/public/pdf/source/20200305/C486355_26A10D38EF8C2A5C37091D0039909270.pdf; Supplier: LCSC; Tolerance: ±10%; Voltage Rated: 50V; Temperature Coefficient: X7R; Check: true
C75 C76 = CL10A226MO7JZNC: 容值:22uF;精度:±20%;额定电压:16V;材质(温度系数):X5R;; LCSC Part Name: 22uF ±20% 16V; Supplier Part: C2762594; Manufacturer: SAMSUNG(三星); Supplier Footprint: 0603; Datasheet: https://atta.szlcsc.com/upload/public/pdf/source/20220811/0832C3B1C642040B023B7A6186895861.pdf; Supplier: LCSC; Tolerance: ±20%; Voltage Rated: 16V; Temperature Coefficient: X5R; Check: true
J7 = X9821WRS-02-9TSN: 参考系列:-;间距:1.25mm;插针结构:1x2P;排数:1;每排PIN数:2;行距:-;公母:母型插口;安装方式:卧贴;额定电流:1A;触头材质:黄铜;触头镀层:锡;工作温度范围:-25℃~+85℃;焊接温度(最大值):260℃;; LCSC Part Name: 1.25mm 1x2P 卧贴 高温; Supplier Part: C397377; Manufacturer: XKB Connectivity(中国星坤); Supplier Footprint: SMD,P=1.25mm; JLCPCB Part Class: 扩展库; Datasheet: https://atta.szlcsc.com/upload/public/pdf/source/20211009/8EC70A3756BF98D2018F34C331B3A406.pdf; Supplier: LCSC; Pitch: 1.25mm; Pins Structure: 1x2P; Number of Rows: 1; Number of PINs Per Row: 2; Gender: 母型插口; Mounting Style: 卧贴; Current Rating (Max): 1A; Contact Material: 黄铜; Contact Plating: 锡; Operating Temperature Range: -25℃~+85℃; Welding Temperature (Max): 260℃; Check: true
MIC1 MIC2 = ZTS6216: 方向:全指向;灵敏度:-38dB;信噪比:65dB;电流消耗:120uA;电源电压:1.5V~3.6V;阻抗:100Ω;; Supplier Part: C481302; Manufacturer: ZILLTEK(钰太); Supplier Footprint: SMD,2.75x1.85x1mm; Datasheet: https://atta.szlcsc.com/upload/public/pdf/source/20200316/C481302_3CBECE2A7DED4DFD53CEA082844189F4.pdf; Supplier: LCSC; Direction: 全指向; Sensitivity: -38dB; SNR(Signal to Noise Ratio): 65dB; Current Consumption: 120uA; Supply Voltage: 1.5V~3.6V; Impedance: 100Ω; Check: true
R28-R35 R37-R39 R41 R44-R52 = 0402WGF0000TCE: 电阻类型:厚膜电阻;阻值:0Ω;精度:±1%;功率:62.5mW;; LCSC Part Name: 0Ω ±1% 62.5mW; Supplier Part: C17168; Manufacturer: UNI-ROYAL(厚声); Supplier Footprint: 0402; Datasheet: https://atta.szlcsc.com/upload/public/pdf/source/20200306/C422600_1E6D84923E4A46A82E41ADD87F860B5C.pdf; Supplier: LCSC; Type: 厚膜电阻; Tolerance: ±1%; Power(Watts): 62.5mW; Temperature Coefficient: ±800ppm/℃; Overload Voltage (Max): 50V; Operating Temperature Range: -55℃~+155℃; Check: true
R36 = 0402WGF510JTCE: 电阻类型:厚膜电阻;阻值:51Ω;精度:±1%;功率:62.5mW;最大工作电压:50V;温度系数:±100ppm/℃;; LCSC Part Name: 51Ω ±1% 62.5mW 厚膜电阻; Supplier Part: C25125; Manufacturer: UNI-ROYAL(厚声); Supplier Footprint: 0402; Datasheet: https://atta.szlcsc.com/upload/public/pdf/source/20200306/C422600_1E6D84923E4A46A82E41ADD87F860B5C.pdf; Supplier: LCSC; Type: 厚膜电阻; Tolerance: ±1%; Power(Watts): 62.5mW; Overload Voltage (Max): 50V; Temperature Coefficient: ±100ppm/℃; Operating Temperature Range: -55℃~+155℃; Check: true
R42 R43 = 0402WGF1003TCE: 电阻类型:厚膜电阻;阻值:100kΩ;精度:±1%;功率:62.5mW;; LCSC Part Name: 100kΩ ±1% 62.5mW; Supplier Part: C25741; Manufacturer: UNI-ROYAL(厚声); Supplier Footprint: 0402; JLCPCB Part Class: 基础库; Datasheet: https://atta.szlcsc.com/upload/public/pdf/source/20200306/C422600_1E6D84923E4A46A82E41ADD87F860B5C.pdf; Supplier: LCSC; Type: 厚膜电阻; Tolerance: ±1%; Power(Watts): 62.5mW; Temperature Coefficient: ±100ppm/℃; Overload Voltage (Max): 50V; Operating Temperature Range: -55℃~+155℃; Check: true
U9 = ES8311: Supplier Part: C962342; Manufacturer: Everest-semi(顺芯); Supplier Footprint: WQFN-20-EP(3x3); JLCPCB Part Class: 扩展库; Datasheet: https://atta.szlcsc.com/upload/public/pdf/source/20210630/C962342_E665EAE7274179BC7C5A390EC8AC685C.pdf; Supplier: LCSC; Check: true
U10 = ES7210: 供电电压:-；-；-；-；-;; LCSC Part Name: 音频解码芯片; Supplier Part: C365743; Manufacturer: Everest-semi(顺芯); Supplier Footprint: QFN-32-EP(4x4); JLCPCB Part Class: 扩展库; Datasheet: https://atta.szlcsc.com/upload/public/pdf/source/20190124/C365743_EF64B9678A6C48719EEF660F22636096.pdf; Supplier: LCSC; Supply Voltage: -；-；-；-；-; Chip Type Parameters/Description: 音频解码芯片; Check: true
U11 = NS4150B_C189961: 功放类型:Class D;输出功率:3Wx1@4Ω;; Supplier Part: C189961; Manufacturer: Nsiway(纳芯威); Supplier Footprint: MSOP-8; Datasheet: https://atta.szlcsc.com/upload/public/pdf/source/20220916/DAE631F3909B9CBB38BDE76E3E6D5896.pdf; Supplier: LCSC; Type of Power Amplifier: Class D; Output Power: 3Wx1@4Ω; Supply Voltage: 3V~5.25V; Check: true

## Nets
2V8: C27.1 C33.2 J6.11 U7.5(VOUT)
3V3: C5.1 C6.1 C8.3(OUT) C9.3(OUT) C12.1 C13.2 C14.2 C15.2 C16.2 C17.1 C18.2 C19.2 C25.1 C26.1 C28.2 C29.1 C30.2 J3.4(VDD) J4.7(VDD) J5.1(VDD) L3.1 R1.1 R2.1 R4.1 R5.1 R6.1 R7.2 R8.2 R9.2 R10.2 R16.2 R20.1 R21.2 R22.2 R25.2 U1.2(3V3) U2.16(VDD) U3.5(VDDIO) U3.8(VDD) U3.12(CS) U4.7(VCC) U4.10(V3) U5.19(V5) U5.20(VDD33) U7.1(VIN) U7.3(CE)
GND: C1.2(GND) C2.2(GND) C3.2 C4.2 C5.2 C6.2 C7.2 C8.2(GND) C9.2(GND) C10.2 C11.2 C12.2 C13.1 C14.1 C15.1 C16.1 C17.2 C18.1 C19.1 C20.1 C21.2 C23.2 C24.1 C25.2 C26.2 C27.2 C28.1 C29.2 C31.2 C32.1 C33.1 D1.2 D2.2 D3.2 D4.2 D5.2 D6.2 D7.2 D8.2 D9.2 D10.2 D11.1 D12.1 D13.1 J1.3 J1.6 J1.7 J2.3 J2.6 J2.7 J3.6(VSS) J3.10 J3.11 J3.12 J3.13 J4.6(GND) J4.8(GND) J4.10(BL_K) J4.11 J4.12 J5.6(GND) J5.7 J5.8 J6.2 J6.15 J7.3 J7.4 R3.1 R11.1 R12.2 R18.1 R24.1 R38.2 SW1.1 SW1.3 SW1.4 SW2.2 SW2.3 SW2.4 U1.1(GND) U1.40(GND) U1.41(GND) U2.4(A1) U2.5(A2) U2.8(VSS) U3.2(SDX) U3.3(SCX) U3.6(GND) U3.7(GND) U4.3(GND) U4.11(GND) U5.25(GND) U6.2(GND) U7.2(VSS) U8.2(GND) USB1.A1B12(GND) USB1.B1A12(GND) USB1.EP X1.2(GND) X1.4(GND)
VBUS: C1.3(OUT) C2.3(OUT) C23.1 C24.2 C31.1 C32.2 F1.1 R15.2 R19.2 R44.2 U6.4(IN) U8.4(IN)
ADC_3V3: C56.2 C57.2 R26.2 R30.2 R33.2 U10.6(VDDP) U10.7(VDDD)
ADC_MIC1N: C66.1 R50.1
ADC_MIC1P: C65.1 R49.1
ADC_MIC2N: C58.1 R46.1
ADC_MIC2P: C61.1 R45.1
ADC_MIC3N: C38.1 R35.2
ADC_MIC3P: C36.1 R34.2
ADC_MICBIAS12: C43.1 R47.2 R51.2 U10.24(MICBIAS12)
AU_3V3: C20.2 C21.1 C22.2 C55.2 L2.1 R17.2 R28.1 R33.1
AU_GND: C34.2 C35.2 C37.2 C39.2 C40.2 C41.2 C42.1 C43.2 C44.1 C45.1 C48.2 C49.2 C50.1 C51.1 C52.1 C53.1 C54.1 C55.1 C56.1 C57.1 C59.2 C60.2 C62.1 C63.1 C64.1 C67.1 C68.1 C69.1 C70.1 C71.1 C74.1 C75.2 C76.2 C77.1 C78.1 C79.1 C80.2 C81.1 C82.1 C83.2 C84.1 C85.1 R27.2 R38.1 R40.2 R48.1 R52.1 U9.5(DGND) U9.10(AGND) U9.20(CE) U9.21(EP) U10.8(GNDD) U10.21(GNDA) U10.33(EP) U11.7(GND)
CH340_D+: U4.1(UD+) U5.6(DP4)
CH340_D-: U4.2(UD-) U5.5(DM4)
CODEC_3V3: C50.2 C51.2 R28.2 R32.1 U9.3(PVDD) U9.4(DVDD)
DTR: Q1.4(E) R13.2 U4.4(DTR#)
DVP_PWDN: J6.8 R25.1 U2.9(IO2)
IO0_BOOT: Q1.3(C) R2.2 SW2.1 U1.27(IO0)
IO1_I2C_SDA: D2.1 J1.2 J5.4(SDA) J6.3 R4.2 U1.39(IO1) U2.2(SDA) U3.14(SDA) U9.19(CDATA) U10.3(CDATA)
IO2_I2C_SCL: D1.1 J1.1 J5.3(SCL) J6.5 R6.2 U1.38(IO2) U2.1(SCL) U3.13(SCL) U9.1(CCLK) U10.4(CCLK)
IO3_DVP_VSYNC: J6.7 U1.15(IO3)
IO4_DVP_D6: J6.14 U1.4(IO4)
IO5_DVP_XCLK: J6.13 U1.5(IO5)
IO6_DVP_D5: J6.16 U1.6(IO6)
IO7_DVP_PCLK: J6.17 U1.7(IO7)
IO8_DVP_D2: J6.22 U1.12(IO8)
IO9_DVP_D7: J6.12 U1.17(IO9)
IO10: D4.1 J2.2 U1.18(IO10)
IO11: D3.1 J2.1 U1.19(IO11)
IO12_I2S_DI: R36.1 R37.1 U1.20(IO12)
IO13_I2S_WS: C64.2 C69.2 U1.21(IO13) U9.8(LRCK) U10.10(LRCK)
IO14_I2S_BCK: C63.2 C68.2 U1.22(IO14) U9.6(SCLK/DMIC_SCL) U10.9(SCLK)
IO15_DVP_D4: J6.18 U1.8(IO15)
IO16_DVP_D0: J6.19 U1.9(IO16)
IO17_DVP_D3: J6.20 U1.10(IO17)
IO18_DVP_D1: J6.21 U1.11(IO18)
IO19_USB_D-: U1.13(IO19) U5.7(DM3)
IO20_USB_D+: U1.14(IO20) U5.8(DP3)
IO21_SD_DAT0: D5.1 J3.7(DAT0) R7.1 U1.23(IO21)
IO38_I2S_MCK: C62.2 C67.2 U1.31(IO38) U9.2(MCLK) U10.5(MCLK)
IO39_LCD_DC: J4.1(DC) U1.32(IO39)
IO40_LCD_MOSI: J4.2(SDA) U1.33(IO40)
IO41_LCD_SCK: J4.5(SCL) U1.34(IO41)
IO42_LCD_BL: R21.1 R23.1 U1.35(IO42)
IO45_I2S_DO: U1.26(IO45) U9.9(DSDIN)
IO46_DVP_HREF: J6.9 R3.2 U1.16(IO46)
IO47_SD_CLK: D6.1 J3.5(CLX) R8.1 U1.24(IO47)
IO48_SD_CMD: D7.1 J3.3(CMD) R9.1 U1.25(IO48)
LCD_CS: J4.3(CS) R16.1 U2.6(IO0)
OUTN: C73.1 C78.2 R29.2 R35.1
OUTP: C72.1 C77.2 R31.2 R34.1
PA_EN: R40.1 U2.7(IO1) U11.1(CTRL)
RESET: C7.1 J4.4(RST) J5.5(RESET) J6.6 Q1.6(C) R1.2 SW1.2 U1.3(EN) U2.15(RESET#)
RTS: Q1.1(E) R14.2 U4.6(RTS#)
U0RXD: U1.36(RXD0) U4.8(TXD)
U0TXD: U1.37(TXD0) U4.9(RXD)
USB_D+: D11.2 U5.15(DPU) USB1.A6(D+) USB1.B6(D+)
USB_D-: D13.2 U5.14(DMU) USB1.A7(D-) USB1.B7(D-)
$1N14443: C1.1(IN) C3.1 J1.5
$1N14452: C8.1(IN) C10.1 J1.4
$1N14925: C2.1(IN) C4.1 J2.5
$1N14929: C9.1(IN) C11.1 J2.4
$1N47659: R5.2 U2.3(A0)
$1N65530: D8.1 J3.2(CD/DAT3) R10.1
$1N65535: D9.1 J3.1(DAT2)
$1N65539: D10.1 J3.8(DAT1)
$2N8462: R11.2 USB1.A5(CC1)
$2N8463: R12.1 USB1.B5(CC2)
$2N8466: L1.1 USB1.A4B9(VBUS) USB1.B4A9(VBUS)
$2N8479: D12.2 F1.2 L1.2
$2N12270: Q1.2(B) R13.1
$2N12271: Q1.5(B) R14.1
$2N33095: R19.1 U8.1(EN)
$2N33161: L3.2 U8.3(LX)
$2N33803: R15.1 U6.1(EN)
$2N33808: L2.2 U6.3(LX)
$2N33828: C22.1 R17.1 R18.2 U6.5(FB)
$2N36848: U5.3(XO) X1.3(OSC2)
$2N36860: U5.4(XI) X1.1(OSC1)
$2N47446: Q2.2(S) R20.2
$2N47448: Q2.1(G) R23.2
$2N47466: J4.9(BL_A) Q2.3(D)
$2N47561: C30.1 R22.1 R24.2 U8.5(FB)
$3N2406: R42.1 U11.3(INP)
$3N2407: R43.1 U11.4(INN)
$3N2410: C79.2 U11.2(Bypass)
$3N2416: C72.2 R42.2
$3N2417: C73.2 R43.2
$3N2422: R39.1 U11.8(VoP)
$3N2423: R41.1 U11.5(VON)
$3N2427: C70.2 J7.2 R41.2
$3N2428: C71.2 J7.1 R39.2
$3N2435: C52.2 R32.2 U9.11(AVDD)
$3N2451: C46.2 C53.2 U9.12(OUTP)
$3N2452: C47.2 C54.2 U9.13(OUTN)
$3N2454: C47.1 R29.1
$3N2455: C46.1 R31.1
$3N2462: C44.2 U9.15(ADCVREF)
$3N2464: C45.2 U9.14(DACVREF)
$3N2466: C42.2 U9.16(VMID)
$3N2469: C85.2 MIC1.1(OUT) R49.2
$3N16346: C74.2 C75.1 C76.1 R44.1 U11.6(VCC)
$3N36391: C83.1 C84.2 MIC1.4(VDD) R51.1
$3N39755: R26.1 U10.1(AD0)
$3N39760: R27.1 U10.2(AD1)
$3N43920: C65.2 U10.16(MIC1P)
$3N43925: C66.2 U10.15(MIC1N)
$3N44013: C59.1 U10.17(REFP12)
$3N44017: C60.1 U10.18(REFQ12)
$3N44121: C61.2 U10.19(MIC2P)
$3N44127: C58.2 U10.20(MIC2N)
$3N44216: C48.1 C49.1 R30.1 U10.22(VDDA) U10.23(VDDM)
$3N44433: C41.1 U10.25(REFQM)
$3N44466: C40.1 U10.26(MICBIAS34)
$3N44552: C39.1 U10.27(MIC4N)
$3N44557: C37.1 U10.28(MIC4P)
$3N44677: C35.1 U10.29(REFP34)
$3N44682: C34.1 U10.30(REFQ34)
$3N44790: C36.2 U10.31(MIC3P)
$3N44795: C38.2 U10.32(MIC3N)
$3N44900: MIC1.2(GND) MIC1.3(GND) R50.2 R52.2
$3N45320: C82.2 MIC2.1(OUT) R45.2
$3N45324: C80.1 C81.2 MIC2.4(VDD) R47.1
$3N45338: MIC2.2(GND) MIC2.3(GND) R46.2 R48.2
$3N50539: R37.2 U10.12(SDOUT2/TDMIN)
$3N50544: R36.2 U10.11(SDOUT1/TDMOUT)

Not connected (* = marked no-connect by the designer): J3 CD*; J5 2(EINT)*; J6 1* 4* 10* 23* 24*; U1 28(IO35)* 29(IO36)* 30(IO37)*; U2 10(IO3)* 11(IO4)* 12(IO5)* 13(IO6)* 14(IO7)*; U3 1(SDO/SA0)* 4(INT1)* 9(INT2)* 10(CS-AUX)* 11(SDO-AUX)*; U4 5(CTS#)*; U5 1(OVCUR)* 2(NC.)* 9(DM2)* 10(DP2)* 11(DM1)* 12(DP1)* 13(LED3/SCL)* 16(RESET/CDP)* 17(NC)* 18(PSELF)* 21(LED4/SDA)* 22(LED1)* 23(LED2)* 24(PWREN)*; U7 4(NC)*; U9 7(ASDOUT)* 17(MIC1N)* 18(MIC1P/DMIC_SDA)*; U10 13(INT)* 14(DMIC_CLK)*; USB1 A8(SBU1)* B8(SBU2)*

## Notes on the sheets
sheet 1
- ESP32-S3   8MB PSRAM  16MB FLASH
- 外部接口（I2C）
- 外部接口（多用）
- 复位按键
- BOOT按键
  用户按键
- 6D姿态传感器
- IO扩展
- QMI8658A_I2C_ADD：0x6a
- I2C
- I2C_ADD：0 0 1 1 A2 A1 A0
  把A0接高电平：0011001,即0x19
- TF卡接口
- PCA9557PW_I2C_ADD：0x19
- 1-SD mode
sheet 2
- USB TYPE-C
- USB转串口
- USB-HUB
- 电源
- DVP摄像头接口
- 电容触摸屏接口
- TFT接口
- FT6X36_I2C_ADDR：0x38
sheet 3
- 音频ADC
- ES7210_I2C_ADD：0x41
- 音频Codec
- ES8311_I2C_ADD：0x18
- 喇叭接口
- 音频功放
- 麦克风
